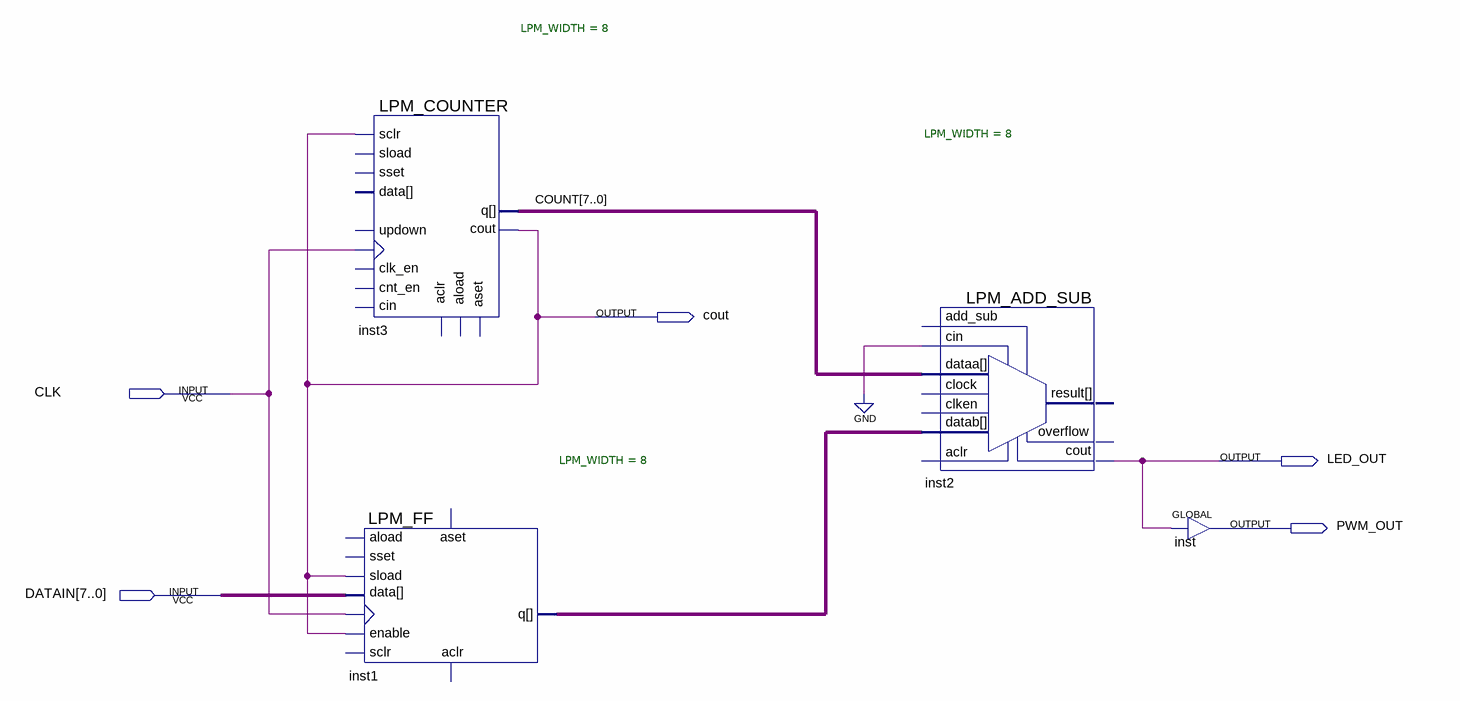
[diagram p0: schematic sheet]
// Quartus schematic Practica_2.bdf as structural Verilog: 4 symbols, 5 pins
module Practica_2 (
  input  CLK,
  input  [7:0] DATAIN,
  output cout,
  output LED_OUT,
  output PWM_OUT
);

  wire [7:0] COUNT, inst1_q;

  LPM_FF #(.LPM_WIDTH(8)) inst1 (
    .enable(cout), .clock(CLK), .sload(cout), .data(DATAIN), .q(inst1_q));  // open: aload, sset, aset, sclr, aclr
  LPM_COUNTER #(.LPM_WIDTH(8)) inst3 (
    .clock(CLK), .sclr(cout), .q(COUNT), .cout(cout));  // open: sload, data, clk_en, aload, aclr, aset, cin, sset, updown, cnt_en
  LPM_ADD_SUB #(.LPM_WIDTH(8)) inst2 (
    .datab(inst1_q), .dataa(COUNT), .cin(1'b0), .cout(LED_OUT));  // open: add_sub, aclr, clock, clken, overflow, result
  GLOBAL inst (.IN(LED_OUT), .OUT(PWM_OUT));
endmodule
